# EAGLE design Theremin (EAGLE 6.5.0)
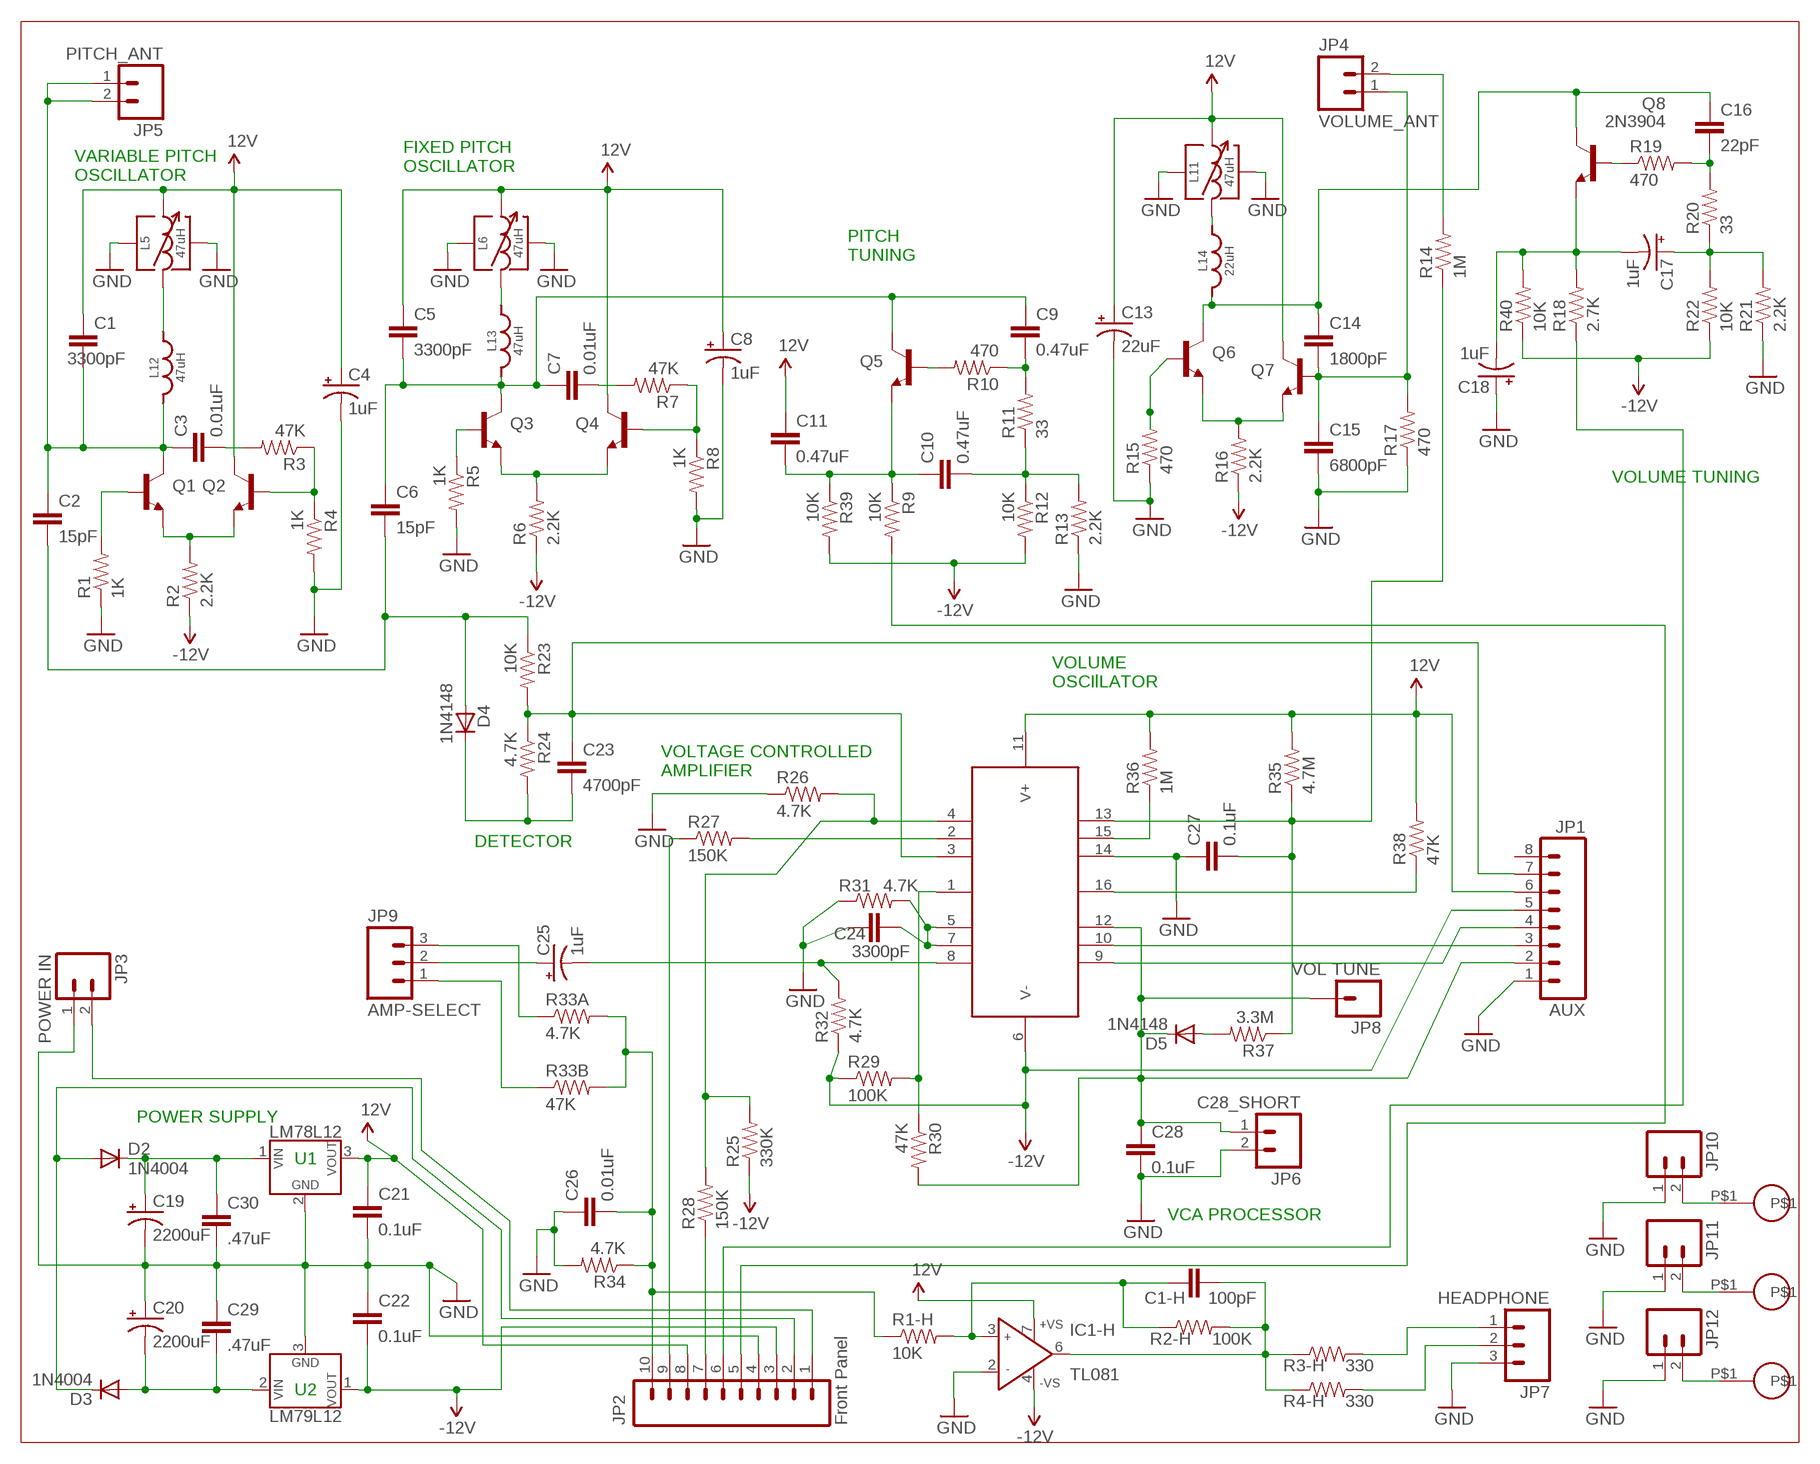
[diagram p0: schematic, sheet 1]

## Parts
C1  3300pF  CAP-9M-RADIAL  [9M-CAP-RADIAL]
C1-H  100pF  CAPPTH  [CAP-PTH-SMALL]
C2  15pF  CAPPTH  [CAP-PTH-SMALL]
C3  0.01uF  CAP-5M-RADIAL  [5M-CAP-RADIAL]
C4  1uF  CAP_POLPTH2  [CPOL-RADIAL-10UF-25V]
C5  3300pF  CAP-9M-RADIAL  [9M-CAP-RADIAL]
C6  15pF  CAPPTH  [CAP-PTH-SMALL]
C7  0.01uF  CAP-5M-RADIAL  [5M-CAP-RADIAL]
C8  1uF  CAP_POLPTH2  [CPOL-RADIAL-10UF-25V]
C9  0.47uF  CAPPTH1  [CAP-PTH-5MM]
C10  0.47uF  CAPPTH1  [CAP-PTH-5MM]
C11  0.47uF  CAPPTH1  [CAP-PTH-5MM]
C13  22uF  CAP_POLPTH4  [CPOL-RADIAL-1000UF-25V]
C14  1800pF  CAPPTH3  [CAP-PTH-LARGE]
C15  6800pF  C5/3  [C5B3]
C16  22pF  CAPEZ  [CAP-PTH-SMALLEZ]
C17  1uF  CAP_POLPTH2  [CPOL-RADIAL-10UF-25V]
C18  1uF  CAP_POLPTH2  [CPOL-RADIAL-10UF-25V]
C19  2200uF  1CM-RADIAL-CAP-POL  [10MM-RADIAL-CPOL]
C20  2200uF  1CM-RADIAL-CAP-POL  [10MM-RADIAL-CPOL]
C21  0.1uF  CAPPTH  [CAP-PTH-SMALL]
C22  0.1uF  CAPPTH  [CAP-PTH-SMALL]
C23  4700pF  CAPPTH  [CAP-PTH-SMALL]
C24  3300pF  CAPPTH  [CAP-PTH-SMALL]
C25  1uF  CAP_POLPTH2  [CPOL-RADIAL-10UF-25V]
C26  0.01uF  CAP-5M-RADIAL  [5M-CAP-RADIAL]
C27  0.1uF  CAPPTH  [CAP-PTH-SMALL]
C28  0.1uF  CAPPTH  [CAP-PTH-SMALL]
C29  .47uF  CAP_  [AXIAL-5MM]
C30  .47uF  CAP_  [AXIAL-5MM]
D2  1N4004  [DO41-10]
D3  1N4004  [DO41-10]
D4  1N4148  DIODE1N4148  [DIODE-1N4148]
D5  1N4148  DIODE1N4148  [DIODE-1N4148]
IC1-H  TL081  AD811N  [DIL08]
JP1  AUX  M081X08  [1X08]
JP2  Front Panel  M10"  [1X10]
JP3  POWER IN  M021X02_NO_SILK  [1X02_NO_SILK]
JP4  VOLUME_ANT  M021X02_NO_SILK  [1X02_NO_SILK]
JP5  PITCH_ANT  M021X02_NO_SILK  [1X02_NO_SILK]
JP6  C28_SHORT  M02LOCK  [1X02_LOCK]
JP7  HEADPHONE  M031X03_NO_SILK  [1X03_NO_SILK]
JP8  VOL TUNE  M01PTH_LONGPAD  [1X01_LONGPAD]
JP9  AMP-SELECT  M03LOCK  [1X03_LOCK]
JP10  M02LOCK  [1X02_LOCK]
JP11  M02LOCK  [1X02_LOCK]
JP12  M02LOCK  [1X02_LOCK]
L5  47uH  SLOT-TEN-SIMPLE  [SLOT-TEN]
L6  47uH  SLOT-TEN-SIMPLE  [SLOT-TEN]
L11  47uH  SLOT-TEN-SIMPLE  [SLOT-TEN]
L12  47uH  DELEVAN-FIXED-INDUCTOR  [FIXED-INDUCTOR-API-DELEVAN]
L13  47uH  DELEVAN-FIXED-INDUCTOR  [FIXED-INDUCTOR-API-DELEVAN]
L14  22uH  DELEVAN-FIXED-INDUCTOR  [FIXED-INDUCTOR-API-DELEVAN]
Q1  2N3904  [TO92]
Q2  2N3904  [TO92]
Q3  2N3904  [TO92]
Q4  2N3904  [TO92]
Q5  2N3904  [TO92]
Q6  2N3904  [TO92]
Q7  2N3904  [TO92]
Q8  2N3904  [TO92]
R1  1K  RESISTORPTH-1/4W  [AXIAL-0.4]
R1-H  10K  RESISTORPTH-1/4W  [AXIAL-0.4]
R2  2.2K  RESISTORPTH-1/4W  [AXIAL-0.4]
R2-H  100K  RESISTORPTH-1/4W  [AXIAL-0.4]
R3  47K  RESISTORPTH-1/4W  [AXIAL-0.4]
R3-H  330  RESISTORPTH-1/4W  [AXIAL-0.4]
R4  1K  RESISTORPTH-1/4W  [AXIAL-0.4]
R4-H  330  RESISTORPTH-1/4W  [AXIAL-0.4]
R5  1K  RESISTORPTH-1/4W  [AXIAL-0.4]
R6  2.2K  RESISTORPTH-1/4W  [AXIAL-0.4]
R7  47K  RESISTORPTH-1/4W  [AXIAL-0.4]
R8  1K  RESISTORPTH-1/4W  [AXIAL-0.4]
R9  10K  RESISTORPTH-1/4W  [AXIAL-0.4]
R10  470  RESISTORPTH-1/4W  [AXIAL-0.4]
R11  33  RESISTORPTH-1/4W  [AXIAL-0.4]
R12  10K  RESISTORPTH-1/4W  [AXIAL-0.4]
R13  2.2K  RESISTORPTH-1/4W  [AXIAL-0.4]
R14  1M  RESISTORPTH-1/4W  [AXIAL-0.4]
R15  470  RESISTORPTH-1/4W  [AXIAL-0.4]
R16  2.2K  RESISTORPTH-1/4W  [AXIAL-0.4]
R17  470  RESISTORPTH-1/4W  [AXIAL-0.4]
R18  2.7K  RESISTORPTH-1/4W  [AXIAL-0.4]
R19  470  RESISTORPTH-1/4W  [AXIAL-0.4]
R20  33  RESISTORPTH-1/4W  [AXIAL-0.4]
R21  2.2K  RESISTORPTH-1/4W  [AXIAL-0.4]
R22  10K  RESISTORPTH-1/4W  [AXIAL-0.4]
R23  10K  RESISTORPTH-1/4W  [AXIAL-0.4]
R24  4.7K  RESISTORPTH-1/4W  [AXIAL-0.4]
R25  330K  RESISTORPTH-1/4W  [AXIAL-0.4]
R26  4.7K  RESISTORPTH-1/4W  [AXIAL-0.4]
R27  150K  RESISTORPTH-1/4W  [AXIAL-0.4]
R28  150K  RESISTORPTH-1/4W  [AXIAL-0.4]
R29  100K  RESISTORPTH-1/4W  [AXIAL-0.4]
R30  47K  RESISTORPTH-1/4W  [AXIAL-0.4]
R31  4.7K  RESISTORPTH-1/4W  [AXIAL-0.4]
R32  4.7K  RESISTORPTH-1/4W  [AXIAL-0.4]
R33A  4.7K  RESISTORPTH-1/4W  [AXIAL-0.4]
R33B  47K  RESISTORPTH-1/4W  [AXIAL-0.4]
R34  4.7K  RESISTORPTH-1/4W  [AXIAL-0.4]
R35  4.7M  RESISTORPTH-1/4W  [AXIAL-0.4]
R36  1M  RESISTORPTH-1/4W  [AXIAL-0.4]
R37  3.3M  RESISTORPTH-1/4W  [AXIAL-0.4]
R38  47K  RESISTORPTH-1/4W  [AXIAL-0.4]
R39  10K  RESISTORPTH-1/4W  [AXIAL-0.4]
R40  10K  RESISTORPTH-1/4W  [AXIAL-0.4]
U1  LM78L12  [TO-92]
U2  LM79L12  [TO-92]
U3  LM13700N  LM13600  [DIL16]
U$1  GROUND-SCREW  [GROUND-SCREW]
U$2  GROUND-SCREW  [GROUND-SCREW]
U$3  GROUND-SCREW  [GROUND-SCREW]

## Nets
5V: C1.P$1 C4.1(+) C5.P$1 C8.1(+) C11.1 C13.1(+) C21.1 IC1-H.7(+VS) JP1.6 JP2.8 L5.IN$1 L6.IN$1 L11.IN$1 Q2.1(C) Q4.1(C) Q7.1(C) R35.P$2 R36.P$2 R38.P$2 U1.3(VOUT) U3.11(V+) ; supply symbol labelled 12V
-12V: JP1.5 R2.P$1 R16.P$1 R22.P$1 R29.P$1 R32.P$1 R40.P$1 U3.6(V-)
GND: C4.2(-) C8.2(-) C13.2(-) C15.2 C18.1(+) C19.P$2(-) C20.P$1(+) C21.2 C22.1 C24.1 C26.P$1 C27.1 C28.2 C29.P$1 C30.P$2 IC1-H.2(IN-) JP1.1 JP2.4 JP3.1 JP6.2 JP7.3 JP10.1 JP11.1 JP12.1 L5.TAB@7 L5.TAB@8 L6.TAB@7 L6.TAB@8 L11.TAB@7 L11.TAB@8 R1.P$1 R4.P$2 R5.P$2 R8.P$2 R13.P$1 R15.P$1 R17.P$1 R21.P$1 R26.P$1 R31.P$1 R34.P$2 U1.2(GND) U2.3(GND) U3.14(IN-PLUS-B)
N$1: Q8.2(B) R19.P$1
N$2: C16.2 R19.P$2 R20.P$2
N$3: C17.1(+) R20.P$1 R21.P$2 R22.P$2
N$4: C14.1 C16.1 L14.P$2 Q6.1(C) Q8.1(C)
N$5: C17.2(-) C18.2(-) Q8.3(E) R18.P$2 R40.P$2
N$6: Q6.3(E) Q7.3(E) R16.P$2
N$7: JP2.6 R18.P$1
N$8: Q6.2(B) R15.P$2
N$9: C14.2 C15.1 JP4.1 Q7.2(B) R17.P$2
N$10: L5.OUT$3(OUT$2) L12.P$1
N$11: L11.OUT$3(OUT$2) L14.P$1
N$12: C20.P$2(-) C29.P$2 D3.A U2.2(VIN)
N$13: C19.P$1(+) C30.P$1 D2.C U1.1(VIN)
N$14: D2.A D3.C JP2.2
N$15: JP4.2 R14.P$2
N$16: Q1.2(B) R1.P$2
N$17: C1.P$2 C2.1 C3.P$1 JP5.1 JP5.2 L12.P$2 Q1.1(C)
N$18: Q1.3(E) Q2.3(E) R2.P$2
N$19: Q2.2(B) R3.P$1 R4.P$1
N$20: C2.2 C6.2 D4.A R23.P$1
N$21: R38.P$1 U3.16(BIAS-IN-B)
N$22: JP1.3 U3.10(B-IN-B)
N$23: JP1.4 U3.9(B-OUT-B)
N$24: C28.1 D5.C JP1.2 JP6.1 JP8.1 R30.P$2 U3.12(OUT-B)
N$25: D5.A R37.P$2
N$26: C27.2 R14.P$1 R35.P$1 R37.P$1 U3.13(IN-MINUS-B)
N$27: R29.P$2 R30.P$1 U3.1(BIAS-IN-A)
N$28: R36.P$1 U3.15(DIODE-BIAS-B)
N$29: C25.2(-) R32.P$2 U3.8(B-OUT-A)
N$30: C25.1(+) JP9.2
N$31: C1-H.1 IC1-H.3(IN+) R1-H.P$2 R2-H.P$1
N$32: C24.2 R31.P$2 U3.5(OUT-A) U3.7(B-IN-A)
N$33: R27.P$2 U3.2(DIODE-BIAS-A)
N$34: JP2.9 R27.P$1
N$35: JP2.7 R28.P$1
N$36: R25.P$2 R26.P$2 R28.P$2 U3.4(IN-MINUS-A)
N$37: C23.1 JP1.7 R23.P$2 R24.P$1 U3.3(IN-PLUS-A)
N$38: C23.2 D4.C R24.P$2
N$39: JP2.1 JP3.2
N$40: C3.P$2 R3.P$2
N$41: C5.P$2 C6.1 C7.P$1 C9.1 L13.P$2 Q3.1(C) Q5.1(C)
N$42: Q3.2(B) R5.P$1
N$43: Q3.3(E) Q4.3(E) R6.P$2
N$44: L6.OUT$3(OUT$2) L13.P$1
N$45: C10.1 C11.2 Q5.3(E) R9.P$1 R39.P$1
N$46: C7.P$2 R7.P$2
N$47: JP2.5 R9.P$2
N$48: Q4.2(B) R7.P$1 R8.P$1
N$49: Q5.2(B) R10.P$2
N$50: C9.2 R10.P$1 R11.P$2
N$51: C10.2 R11.P$1 R12.P$1 R13.P$2
N$52: JP9.3 R33A.P$1
N$53: JP9.1 R33B.P$1
N$54: C26.P$2 JP2.10 R1-H.P$1 R33A.P$2 R33B.P$2 R34.P$1
N$55: C1-H.2 IC1-H.6(OUT) R2-H.P$2 R3-H.P$1 R4-H.P$1
N$56: JP7.1 R3-H.P$2
N$57: JP7.2 R4-H.P$2
N$58: JP10.2 U$2.P$1
N$59: JP11.2 U$1.P$1
N$60: JP12.2 U$3.P$1
VNEG: C22.2 IC1-H.4(-VS) JP2.3 R6.P$1 R12.P$2 R25.P$1 R39.P$2 U2.1(VOUT) ; supply symbol labelled -12V
Unconnected: JP1.8

## Notes on the sheet
- FIXED PITCH
  OSCILLATOR
- VARIABLE PITCH
  OSCILLATOR
- PITCH
  TUNING
- VOLUME TUNING
- VOLUME 
  OSCIlLATOR
- VOLTAGE CONTROLLED
  AMPLIFIER
- DETECTOR
- POWER SUPPLY
- LM78L12
- U1
- VCA PROCESSOR
- U2
- LM79L12

## Library data of the parts
C1 C5 = marky-parts:CAP-9M-RADIAL
C1-H C2 C6 C9-C11 C14 C21-C24 C27-C30 = SparkFun-Capacitors:CAP: Capacitor Standard 0603 ceramic capacitor, and 0.1" leaded capacitor.
C3 C7 C26 = marky-parts:CAP-5M-RADIAL
C4 C8 C17 C18 C25 = SparkFun-Passives:CAP_POL: Capacitor Polarized These are standard SMD and PTH capacitors. Normally 10uF, 47uF, and 100uF in electrolytic and tantalum varieties. Always verify the external diameter of the through hole cap, it varies with capacity, voltage, and manufacturer. The EIA devices should be standard.
C13 = SparkFun-Capacitors:CAP_POL: Capacitor Polarized These are standard SMD and PTH capacitors. Normally 10uF, 47uF, and 100uF in electrolytic and tantalum varieties. Always verify the external diameter of the through hole cap, it varies with capacity, voltage, and manufacturer. The EIA devices should be standard.
C15 = capacitor-wima:C: CAPACITOR naming: grid - package width
C16 = SparkFun-Passives:CAP: Capacitor Standard 0603 ceramic capacitor, and 0.1" leaded capacitor.
C19 C20 = marky-parts:1CM-RADIAL-CAP-POL: 1cm Radial Polarized Capacitor
D2 D3 = diode:1N4004: DIODE general purpose rectifier, 1 A
D4 D5 = SparkFun-DiscreteSemi:DIODE: Diode These are standard reverse protection diodes and small signal diodes. SMA package can handle up to about 1A. SOD-323 can handle about 200mA. What the SOD-323 package when ordering, there are some mfgs out there that are 5-pin packages.
IC1-H = analog-devices:AD811: High Performance Video Op Amp Source: http://www.analog.com/static/imported-files/data_sheets/AD811.pdf; MF: ALTERA CORPORATION; MPN: AD811AN; OC_FARNELL: 1464857; OC_NEWARK: 05F7667
JP1 = SparkFun-Connectors:M08: Header 8 Standard 8-pin 0.1" header. Use with straight break away headers (SKU : PRT-00116), right angle break away headers (PRT-00553), swiss pins (PRT-00743), machine pins (PRT-00117), and female headers (PRT-00115).
JP2 = SparkFun-Connectors:M10: Header 10 Standard 10-pin 0.1" header. Use with straight break away headers (SKU : PRT-00116), right angle break away headers (PRT-00553), swiss pins (PRT-00743), machine pins (PRT-00117), and female headers (PRT-00115).
JP3-JP6 JP10-JP12 = SparkFun-Connectors:M02: Standard 2-pin 0.1" header. Use with - straight break away headers ( PRT-00116) - right angle break away headers (PRT-00553) - swiss pins (PRT-00743) - machine pins (PRT-00117) - female headers (PRT-00115) Molex polarized connector foot print use with: PRT-08233 with associated crimp pins and housings. 2.54_SCREWTERM for use with PRT-10571. 3.5mm Screw Terminal footprints for PRT-08084 5mm Screw Terminal footprints for use with PRT-08433
JP7 JP9 = SparkFun-Connectors:M03: Header 3 Standard 3-pin 0.1" header. Use with straight break away headers (SKU : PRT-00116), right angle break away headers (PRT-00553), swiss pins (PRT-00743), machine pins (PRT-00117), and female headers (PRT-00115). Molex polarized connector foot print use with SKU : PRT-08232 with associated crimp pins and housings.
JP8 = SparkFun-Connectors:M01: Header 1 Standard 1-pin 0.1" header. Use with straight break away headers (SKU : PRT-00116), right angle break away headers (PRT-00553), swiss pins (PRT-00743), machine pins (PRT-00117), and female headers (PRT-00115).
L5 L6 L11 = marky-parts:SLOT-TEN-SIMPLE
L12-L14 = marky-parts:DELEVAN-FIXED-INDUCTOR
Q1-Q8 = transistor:2N3904: NPN TRANSISTOR
R1 R1-H R2 R2-H R3 R3-H R4 R4-H R5-R32 R33A R33B R34-R40 = SparkFun-Resistors:RESISTOR: Resistor Basic schematic elements and footprints for 0603, 1206, and PTH resistors.
U1 = marky-parts:LM78L12: LM78LXX Series 3-Terminal Positive Regulators
U2 = marky-parts:LM79L12: -12V regulator
U3 = marky-parts:LM13600: LM13600 Operational Transconductance Amplifiers with Linearizing Diodes and Buffers
U$1-U$3 = marky-parts:GROUND-SCREW: Screw hole with a pad that can be grounded

## Board
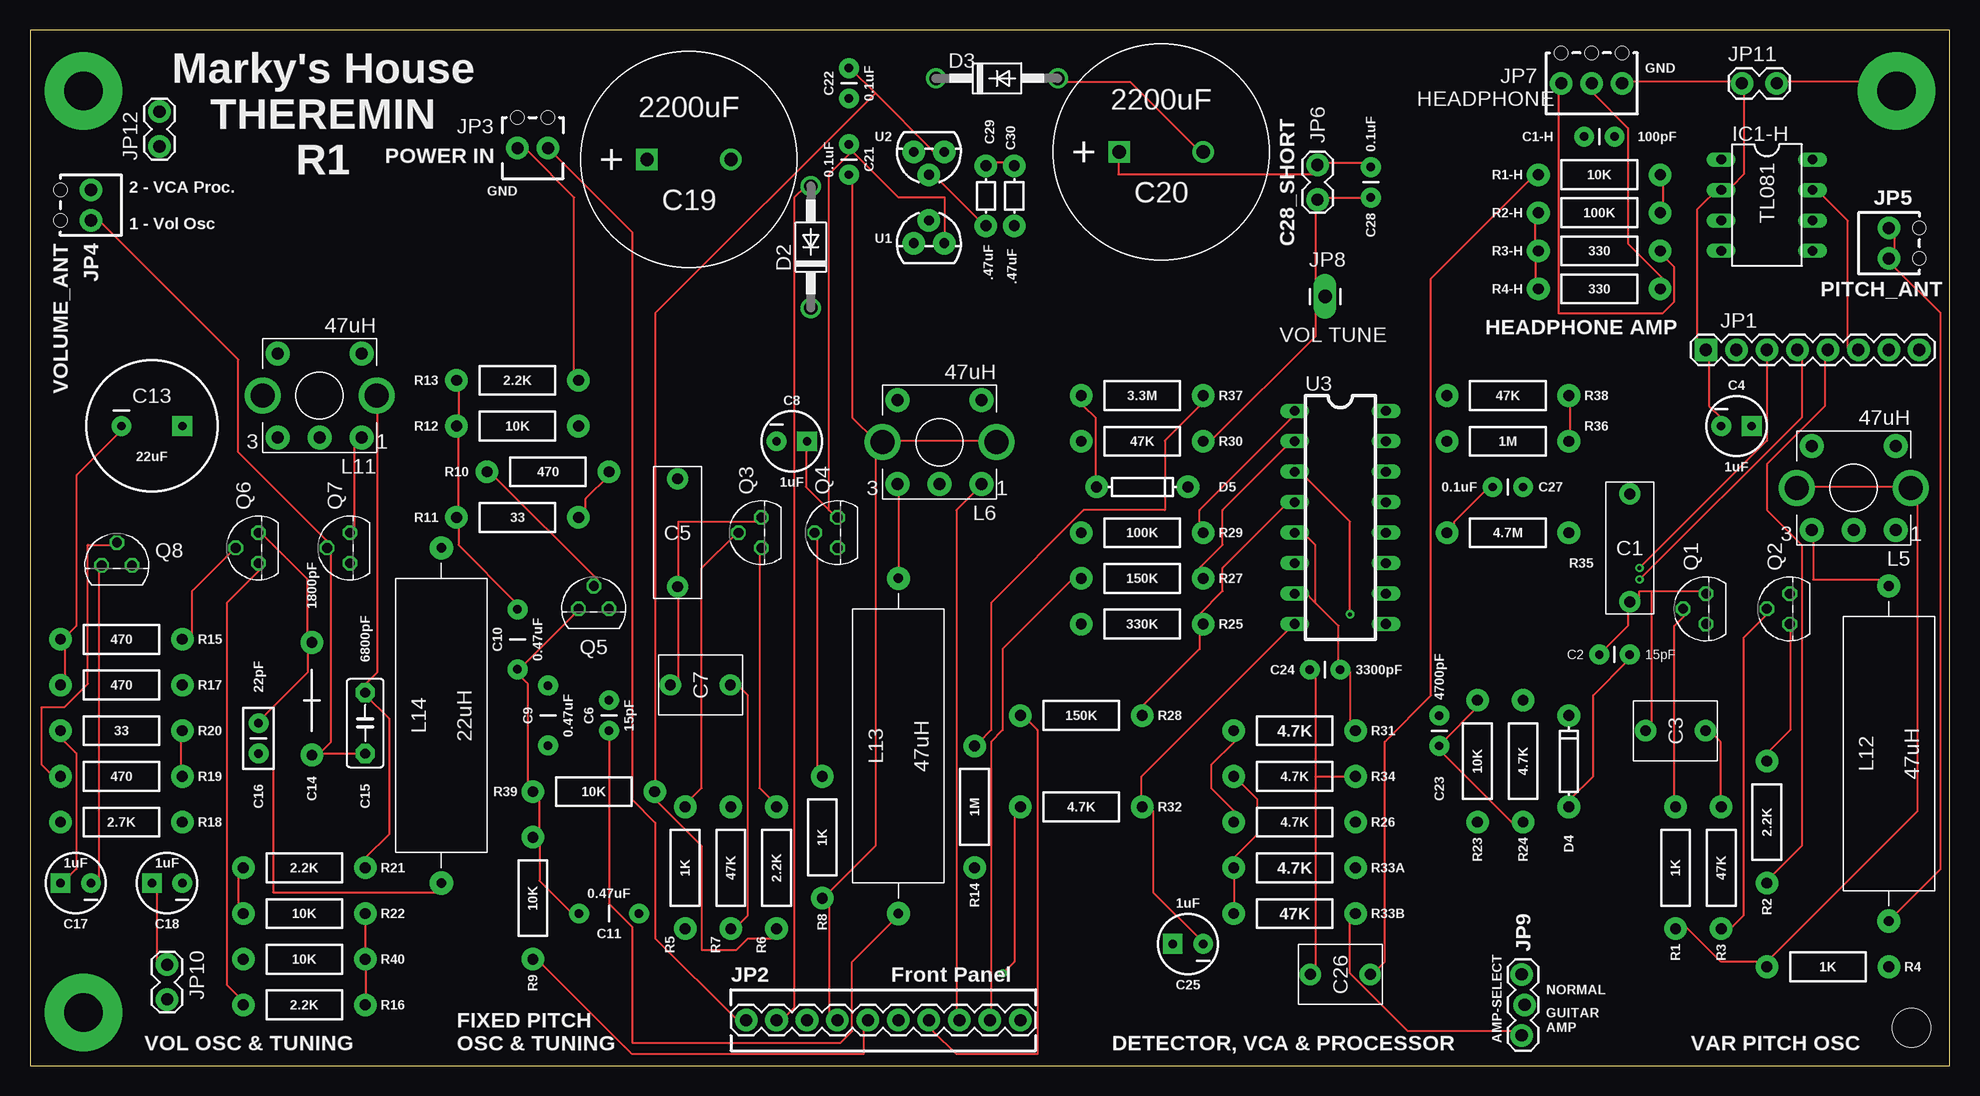
[diagram p1: board, top side]
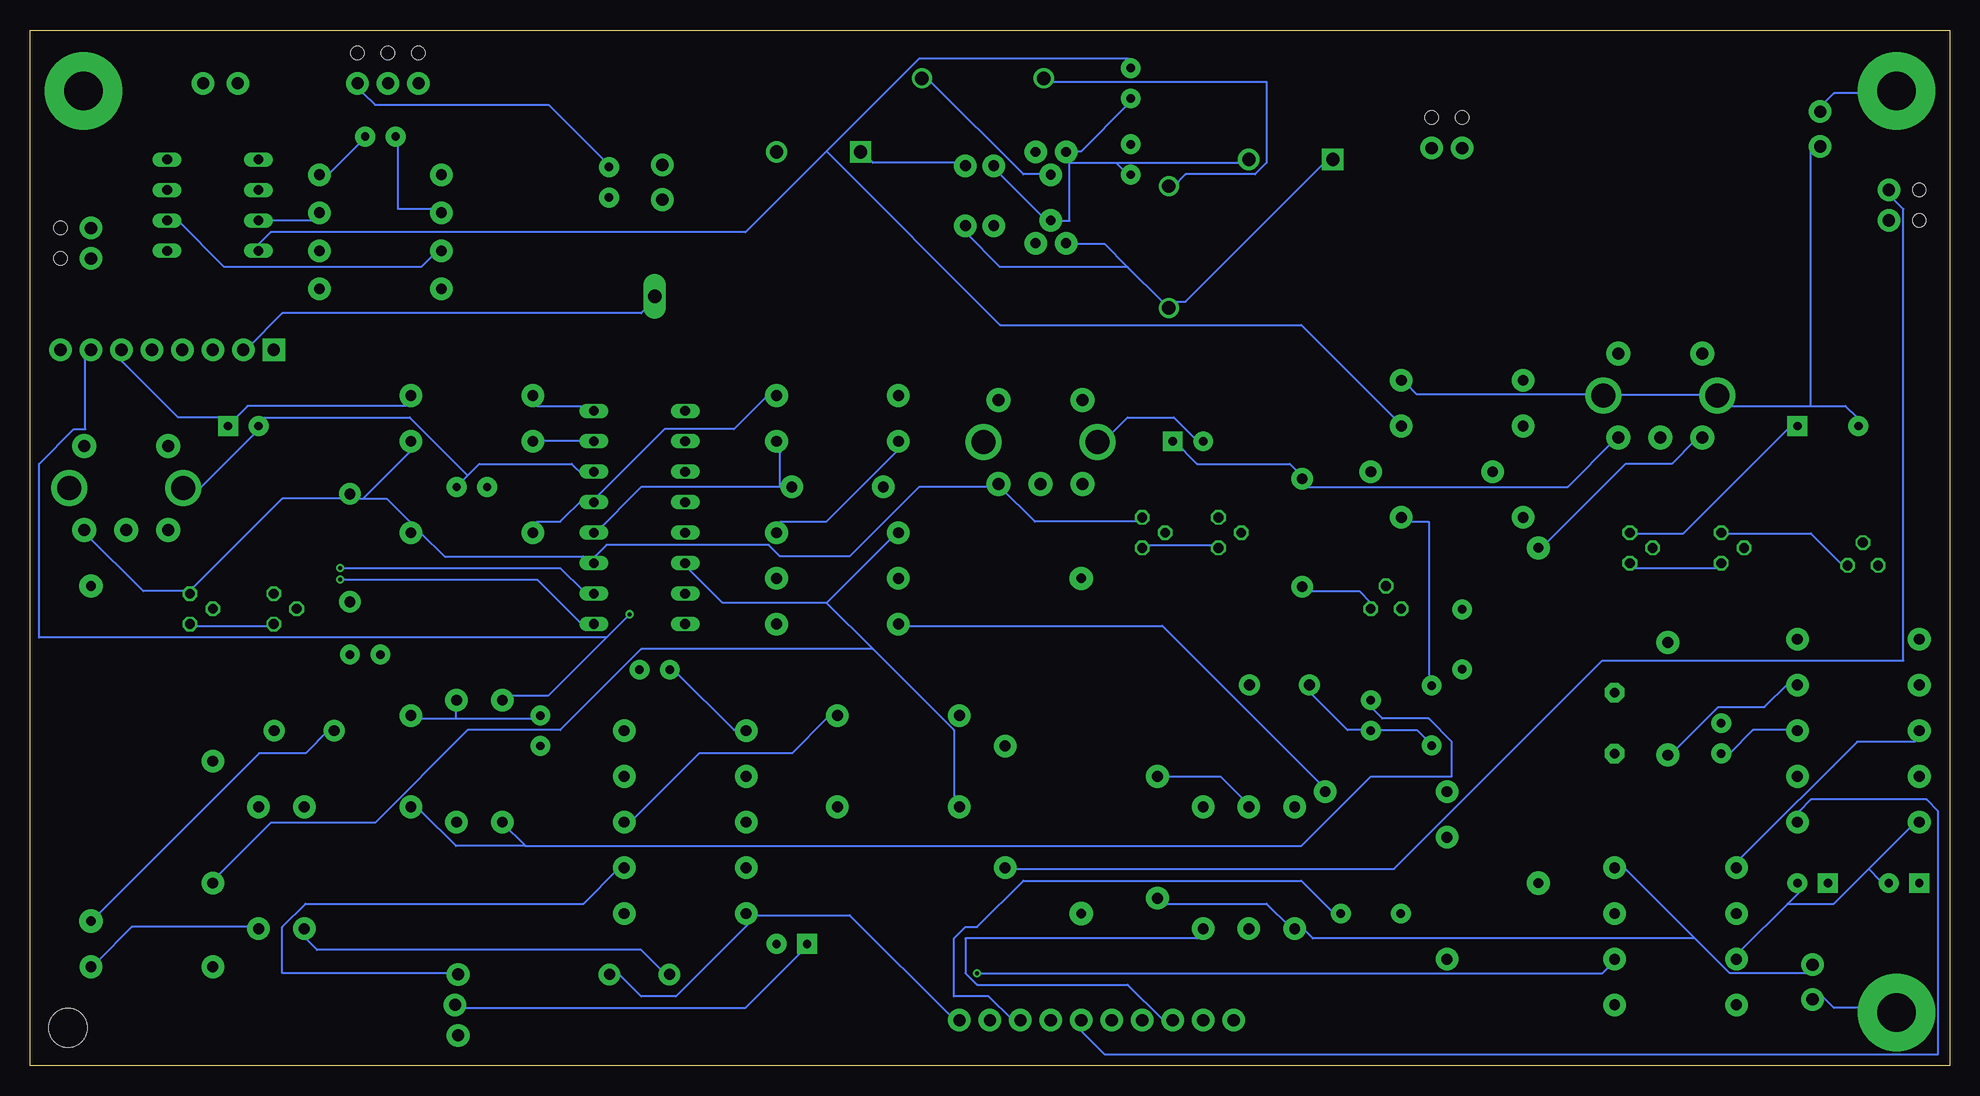
[diagram p2: board, bottom side, seen from below]

Size 160.02 x 86.36 mm. Coordinates in mm from the lower left corner, seen from the top.
Outline: 0,0 160,0 160.02,86.36 0,86.36 0,0
Copper layers (1*16): Top 0.0356mm / dielectric 1.5011mm / Bottom 0.0356mm
Design rules "LaenPCBOrder": minimum track width 6mil, minimum drill 13mil, track to track 6mil, track to pad 6mil, pad to pad 6mil, via to via 6mil, smd to smd 6mil, copper to edge 15mil, drill to drill 6mil, minimum pad ring 7mil, minimum via ring 7mil, stop-mask expansion 3mil, vias tented up to drill 0mil, thermal gap 10mil
Holes 3.2 mm at 156.84,3.17
Holes 1.1 mm at 2.54,70.48 2.54,73.03 157.48,69.85 157.48,67.31 127.64,84.45 130.18,84.45 132.72,84.45 40.64,79.06 43.18,79.06

### Footprints (pad centres in the part's own frame; a part is rotated, then mirrored left to right if it is on the bottom)
9M-CAP-RADIAL = drill 0.9 pad 1.778: P$1 0,4.5; P$2 0,-4.5
CAP-PTH-SMALL = drill 0.7 pad 1.651: 1 0,0; 2 2.54,0
5M-CAP-RADIAL = drill 0.9 pad 1.778: P$1 0,2.5; P$2 0,-2.5
CPOL-RADIAL-10UF-25V = drill 0.7 pad 1.651 square: 1 1.27,0 | drill 0.7 pad 1.651: 2 -1.27,0
CAP-PTH-5MM = drill 0.7 pad 1.651: 1 -2.5,0; 2 2.5,0
CPOL-RADIAL-1000UF-25V = drill 0.7 pad 1.651 square: 1 2.54,0 | drill 0.7 pad 1.651: 2 -2.54,0
CAP-PTH-LARGE = drill 0.9 pad 1.905: 1 -4.826,0; 2 4.572,0
C5B3 = drill 0.813 pad 1.6 octagon: 1 -2.54,0; 2 2.54,0
CAP-PTH-SMALLEZ = drill 0.7 pad 1.651: 1 0,0; 2 2.54,0
10MM-RADIAL-CPOL = drill 1.1 pad 1.778 square: P$1 -3.5,0 | drill 1.1 pad 1.778: P$2 3.5,0
AXIAL-5MM = drill 0.9 pad 1.88: P$1 -2.5,0; P$2 2.5,0
DO41-10 = drill 1.118: A 5.08,0; C -5.08,0
DIODE-1N4148 = drill 0.9 pad 1.88: A -3.81,0; C 3.81,0
DIL08 = drill 0.813 long: 1 -3.81,-3.81; 2 -1.27,-3.81; 3 1.27,-3.81; 4 3.81,-3.81; 5 3.81,3.81; 6 1.27,3.81; 7 -1.27,3.81; 8 -3.81,3.81
1X08 = drill 1.016 pad 1.88 square: 1 0,0 | drill 1.016 pad 1.88: 2 2.54,0; 3 5.08,0; 4 7.62,0; 5 10.16,0; 6 12.7,0; 7 15.24,0; 8 17.78,0
1X10 = drill 1.016 pad 1.88: 1 0,0; 2 2.54,0; 3 5.08,0; 4 7.62,0; 5 10.16,0; 6 12.7,0; 7 15.24,0; 8 17.78,0; 9 20.32,0; 10 22.86,0
1X02_NO_SILK = drill 1.016 pad 1.88: 1 0,0; 2 2.54,0
1X02_LOCK = drill 1.016 pad 1.88: 1 -0.178,0; 2 2.718,0
1X03_NO_SILK = drill 1.016 pad 1.88: 1 0,0; 2 2.54,0; 3 5.08,0
1X01_LONGPAD = drill 1.118 pad 1.88 long: 1 0,0
1X03_LOCK = drill 1.016 pad 1.88: 1 0,0.127; 2 2.54,-0.127; 3 5.08,0.127
SLOT-TEN = drill 1 pad 2: IN$1 -3.5,3.5; OUT$3 3.5,3.5; P$2 0,3.5; P$4 3.5,-3.5; P$6 -3.5,-3.5 | drill 2 pad 3: TAB@7 -4.75,0; TAB@8 4.75,0
FIXED-INDUCTOR-API-DELEVAN = drill 0.8 pad 1.93: P$1 0,13.97; P$2 0,-13.97
TO92 = drill 0.813 octagon: 1 1.27,0; 2 0,1.905; 3 -1.27,0
AXIAL-0.4 = drill 0.9 pad 1.88: P$1 -5.08,0; P$2 5.08,0
TO-92 = drill 0.813 pad 1.88: 1 -1.27,0; 2 0,1.905; 3 1.27,0
DIL16 = drill 0.813 long: 1 -8.89,-3.81; 2 -6.35,-3.81; 3 -3.81,-3.81; 4 -1.27,-3.81; 5 1.27,-3.81; 6 3.81,-3.81; 7 6.35,-3.81; 8 8.89,-3.81; 9 8.89,3.81; 10 6.35,3.81; 11 3.81,3.81; 12 1.27,3.81; 13 -1.27,3.81; 14 -3.81,3.81; 15 -6.35,3.81; 16 -8.89,3.81
GROUND-SCREW = drill 3.2 pad 6.452: P$1 0,0

### Placement (x,y rotation side)
C1  133.35,43.18 0 top
C1-H  132.08,77.47 180 top
C2  130.81,34.29 0 top
C3  137.16,27.94 90 top
C4  142.24,53.34 0 top
C5  53.98,44.45 0 top
C6  48.26,27.94 90 top
C7  55.88,31.75 90 top
C8  63.5,52.07 0 top
C9  43.18,29.21 90 top
C10  40.64,35.56 90 top
C11  48.26,12.7 180 top
C13  10.16,53.34 0 top
C14  23.5,30.48 270 top
C15  27.94,28.57 90 top
C16  19.05,28.57 270 top
C17  3.81,15.24 180 top
C18  11.43,15.24 180 top
C19  54.93,75.56 0 top
C20  94.3,76.2 0 top
C21  68.26,76.83 270 top
C22  68.26,80.64 90 top
C23  117.47,26.67 90 top
C24  106.68,33.02 0 top
C25  96.52,10.16 180 top
C26  109.22,7.62 90 top
C27  124.46,48.26 180 top
C28  111.76,72.39 90 top
C29  79.68,72.54 270 top
C30  82.05,72.54 90 top
D2  65.09,68.26 90 top
D3  80.6,82.33 0 top
D4  128.27,25.4 90 top
D5  92.71,48.26 0 top
IC1-H  144.78,71.75 270 top
JP1  139.7,59.69 0 top
JP2  59.69,3.81 0 top
JP3  40.64,76.52 0 top
JP4  5.08,70.48 90 top
JP5  154.94,67.31 90 top
JP6  107.31,72.39 90 top
JP7  127.64,81.92 0 top
JP8  107.95,64.14 0 top
JP9  124.46,2.54 90 top
JP10  11.43,8.26 270 top
JP11  142.88,81.92 0 top
JP12  10.79,76.83 90 top
L5  152,48.19 180 top
L6  75.81,52 180 top
L11  24.13,55.88 180 top
L12  154.94,26.04 0 top
L13  72.39,26.67 0 top
L14  34.29,29.21 0 top
Q1  139.7,38.1 90 top
Q2  146.69,38.1 90 top
Q3  60.96,44.45 90 top
Q4  67.31,44.45 90 top
Q5  46.99,38.1 0 top
Q6  19.05,43.18 90 top
Q7  26.67,43.18 90 top
Q8  7.24,41.72 0 top
R1  137.16,16.51 90 top
R1-H  130.81,74.3 0 top
R2  144.78,20.32 90 top
R2-H  130.81,71.12 180 top
R3  140.97,16.51 90 top
R3-H  130.81,67.94 0 top
R4  149.86,8.26 180 top
R4-H  130.81,64.77 0 top
R5  54.61,16.51 270 top
R6  62.23,16.51 90 top
R7  58.42,16.51 270 top
R8  66.04,19.05 270 top
R9  41.91,13.97 270 top
R10  43.18,49.53 180 top
R11  40.64,45.72 0 top
R12  40.64,53.34 0 top
R13  40.64,57.15 180 top
R14  78.74,21.59 270 top
R15  7.62,35.56 0 top
R16  22.86,5.08 180 top
R17  7.62,31.75 0 top
R18  7.62,20.32 180 top
R19  7.62,24.13 0 top
R20  7.62,27.94 0 top
R21  22.86,16.51 180 top
R22  22.86,12.7 180 top
R23  120.65,25.4 90 top
R24  124.46,25.4 90 top
R25  92.71,36.83 0 top
R26  105.41,20.32 0 top
R27  92.71,40.64 0 top
R28  87.63,29.21 0 top
R29  92.71,44.45 0 top
R30  92.71,52.07 0 top
R31  105.41,27.94 0 top
R32  87.63,21.59 0 top
R33A  105.41,16.51 180 top
R33B  105.41,12.7 180 top
R34  105.41,24.13 0 top
R35  123.19,44.45 0 top
R36  123.19,52.07 0 top
R37  92.71,55.88 180 top
R38  123.19,55.88 0 top
R39  46.99,22.86 0 top
R40  22.86,8.89 180 top
U1  74.93,68.58 0 top
U2  74.93,76.2 180 top
U3  109.22,45.72 270 top
U$1  155.57,81.28 0 top
U$2  4.45,4.45 0 top
U$3  4.45,81.28 0 top

### Tracks (layer width: path | path; a pad name or v marks a point on that pad's centre or on a via)
5V
  Top 0.152: IC1-H.7 148.64,73.36 151.54,70.46 151.54,59.84 JP1.6 | R36.P$2 128.37,52.12 128.37,55.02 R38.P$2 | Q7.1 27.03,44.4 27.03,52.12 L11.IN$1 | 68.53,76.25 72.39,72.39 76.25,72.39 76.25,69.49 U1.3 | 66.6,46.33 64.67,48.26 64.67,52.12 C8.1 | 66.6,46.33 67.56,45.36 Q4.1 | 68.53,76.25 66.6,74.32 66.6,46.33 | 68.53,76.25 C21.1 | JP2.8 77.22,3.86 77.22,46.33 79.15,48.26 L6.IN$1
  Bottom 0.152: R38.P$2 128.37,55.02 141.88,55.02 142.85,54.05 C4.1 143.81,54.05 147.68,54.05 152.5,58.88 JP1.6 | 146.71,39.57 138.99,47.3 134.16,47.3 C1.P$1 133.2,47.3 132.23,47.3 | 146.71,39.57 150.57,39.57 155.4,44.4 L5.IN$1 | 146.71,39.57 Q2.1 | 132.23,47.3 130.3,47.3 128.37,45.36 R35.P$2 127.41,44.4 125.48,42.47 113.89,42.47 U3.11 112.93,42.47 111.96,43.43 98.45,43.43 97.48,42.47 91.69,42.47 85.9,48.26 80.11,48.26 L6.IN$1 79.15,48.26 76.25,45.36 67.56,45.36 Q4.1 | 132.23,47.3 128.37,51.16 R36.P$2 | C11.1 51.16,12.55 54.05,15.44 77.22,15.44 81.08,11.58 82.04,11.58 83.01,10.62 83.01,5.79 80.11,5.79 78.18,3.86 JP2.8 | C13.1 13.51,53.09 22.2,44.4 27.03,44.4 Q7.1 | C8.1 64.67,52.12 62.74,50.19 55.02,50.19 54.05,49.23 C5.P$1 54.05,48.26 31.85,48.26 27.99,52.12 L11.IN$1
-12V  (via drill 0.33)
  Top 0.152: R2.P$1 144.78,15.44 147.68,18.34 147.68,43.43 144.78,46.33 144.78,50.19 149.61,55.02 149.61,58.88 JP1.5 | R16.P$1 27.99,5.79 27.99,8.69 R40.P$1 27.99,9.65 27.99,12.55 R22.P$1 | v81.08,7.72 82.04,8.69 82.04,21.23 R32.P$1
  Bottom 0.152: 93.62,38.61 102.31,38.61 105.21,41.5 U3.6 | 93.62,38.61 87.83,44.4 R29.P$1 | 93.62,38.61 89.76,34.75 | 89.76,34.75 83.01,27.99 83.01,22.2 R32.P$1 | v81.08,7.72 28.96,7.72 27.99,8.69 R40.P$1 | 89.76,34.75 109.07,34.75 115.82,27.99 123.55,27.99 131.27,20.27 139.95,20.27 144.78,15.44 R2.P$1
GND
  Top 0.152: JP2.4 66.6,3.86 66.6,13.51 R8.P$2 66.6,14.48 70.46,18.34 70.46,51.16 L6.TAB@8 | C18.1 10.62,14.48 10.62,8.69 JP10.1 | R17.P$1 2.9,31.85 2.9,34.75 R15.P$1 2.9,35.71 3.86,36.68 3.86,49.23 7.72,53.09 C13.2 | L11.TAB@7 28.96,55.02 28.96,32.82 27.99,31.85 C15.2 27.99,30.89 29.92,28.96 29.92,19.3 27.99,17.37 R21.P$1 | JP3.1 41.5,76.25 45.36,72.39 45.36,57.91 R13.P$1 | L6.TAB@7 80.11,52.12 71.42,52.12 L6.TAB@8 | C28.2 111,75.29 108.1,75.29 JP6.2 107.14,74.32 90.73,74.32 90.73,76.25 C20.P$1 | C29.P$1 80.11,75.29 82.04,75.29 C30.P$2 | L6.TAB@8 70.46,52.12 68.53,54.05 68.53,74.32 C21.2 | 144.78,8.69 140.92,8.69 138.02,11.58 R1.P$1 | 107.14,24.13 107.14,32.82 C24.1 | 107.14,24.13 107.14,7.72 C26.P$1 | R26.P$1 100.38,21.23 98.45,23.16 98.45,25.09 100.38,27.03 R31.P$1 | 107.14,24.13 R34.P$2 | JP7.3 133.2,82.04 141.88,82.04 JP11.1 142.85,81.08 142.85,74.32 141.88,73.36 IC1-H.2 140.92,73.36 138.99,71.42 138.99,59.84 JP1.1 139.95,58.88 139.95,55.02 140.92,54.05 C4.2 | L5.TAB@8 147.68,48.26 156.36,48.26 L5.TAB@7 157.33,47.3 157.33,21.23 144.78,8.69 | 144.78,8.69 R4.P$2
  Bottom 0.152: R8.P$2 65.63,13.51 56.95,13.51 55.02,11.58 R5.P$2 54.05,11.58 53.09,10.62 21.23,10.62 | 21.23,10.62 18.34,7.72 11.58,7.72 JP10.1 | 21.23,10.62 27.03,16.41 R21.P$1 | 11.58,55.02 19.3,55.02 L11.TAB@8 20.27,55.98 27.99,55.98 L11.TAB@7 28.96,55.98 44.4,55.98 45.36,56.95 R13.P$1 | 11.58,55.02 8.69,55.02 7.72,54.05 C13.2 | 11.58,55.02 11.58,76.25 JP12.1 | C8.2 62.74,52.12 64.67,54.05 68.53,54.05 70.46,52.12 L6.TAB@8 | 69.49,75.29 68.53,74.32 C21.2 | 73.36,75.29 69.49,75.29 | C22.1 68.53,80.11 72.39,76.25 73.36,76.25 U2.3 73.36,75.29 | 69.49,75.29 58.88,75.29 C19.P$2 | C29.P$1 79.15,74.32 75.29,70.46 U1.2 74.32,70.46 73.36,70.46 73.36,75.29 | C20.P$1 90.73,76.25 89.76,75.29 82.04,75.29 C30.P$2 | C24.1 106.17,32.82 101.35,27.99 100.38,27.99 R31.P$1 | R1.P$1 137.06,10.62 136.09,9.65 109.07,9.65 107.14,7.72 C26.P$1 | 123.55,49.23 124.51,48.26 C27.1 | 123.55,49.23 122.58,50.19 114.86,50.19 113.89,49.23 U3.14 | L5.TAB@8 146.71,48.26 145.75,48.26 140.92,53.09 C4.2 140.92,54.05 128.37,54.05 123.55,49.23 | C28.2 111.96,75.29 116.79,80.11 131.27,80.11 132.23,81.08 JP7.3
N$1
  Top 0.152: Q8.2 6.76,43.43 4.83,43.43 4.83,31.85 2.9,29.92 0.96,29.92 0.96,25.09 1.93,24.13 R19.P$1
N$2
  Top 0.152: R19.P$2 12.55,24.13 12.55,27.03 R20.P$2
  Bottom 0.152: C16.2 18.34,26.06 16.41,27.99 13.51,27.99 R20.P$2
N$3
  Top 0.152: R22.P$2 17.37,13.51 17.37,16.41 R21.P$2 | C17.1 2.9,15.44 3.86,16.41 3.86,26.06 2.9,27.03 R20.P$1
  Bottom 0.152: R21.P$2 17.37,17.37 7.72,27.03 2.9,27.03 R20.P$1
N$4
  Top 0.152: 20.27,29.92 23.16,32.82 23.16,34.75 C14.1 23.16,35.71 23.16,40.54 19.3,44.4 Q6.1 | 20.27,29.92 19.3,28.96 C16.1 | 20.27,29.92 20.27,14.48 33.78,14.48 L14.P$2
  Bottom 0.152: Q8.1 8.69,41.5 11.58,44.4 19.3,44.4 Q6.1
N$5
  Top 0.152: Q8.3 5.79,41.5 5.79,15.44 C17.2
  Bottom 0.152: 13.51,13.51 17.37,9.65 R40.P$2 | 13.51,13.51 12.55,14.48 C18.2 | 6.76,16.41 9.65,13.51 13.51,13.51 | 6.76,16.41 2.9,20.27 R18.P$2 | 6.76,16.41 5.79,15.44 C17.2
N$6
  Top 0.152: R16.P$2 17.37,5.79 16.41,6.76 16.41,38.61 19.3,41.5 Q6.3
  Bottom 0.152: Q6.3 19.3,41.5 27.03,41.5 Q7.3
N$7
  Bottom 0.152: R18.P$1 12.55,21.23 11.58,22.2 1.93,22.2 0.96,21.23 0.96,0.96 70.46,0.96 72.39,2.9 JP2.6
N$8
  Top 0.152: Q6.2 17.37,43.43 13.51,39.57 13.51,35.71 R15.P$2
N$9
  Top 0.152: 25.09,43.43 25.09,27.03 24.13,26.06 | 24.13,26.06 27.99,26.06 C15.1 | 24.13,26.06 C14.2 | 25.09,43.43 17.37,51.16 17.37,58.88 5.79,70.46 JP4.1 | 25.09,43.43 Q7.2
  Bottom 0.152: R17.P$2 13.51,31.85 15.44,29.92 19.3,29.92 23.16,26.06 C14.2
N$10
  Top 0.152: L12.P$1 154.43,40.54 148.64,40.54 148.64,44.4 L5.OUT$3
N$11
  Bottom 0.152: L14.P$1 33.78,43.43 27.03,50.19 23.16,50.19 21.23,52.12 L11.OUT$3
N$12
  Top 0.152: C20.P$2 97.48,76.25 91.69,82.04 85.9,82.04 D3.A | C29.P$2 79.15,70.46 75.29,74.32 U2.2
  Bottom 0.152: D3.A 84.94,82.04 77.22,74.32 75.29,74.32 U2.2
N$13
  Bottom 0.152: 68.53,66.6 70.46,68.53 73.36,68.53 U1.1 | 68.53,66.6 65.63,63.7 D2.C 64.67,63.7 63.7,63.7 52.12,75.29 C19.P$1 | 68.53,66.6 79.15,66.6 82.04,69.49 C30.P$1
N$14
  Top 0.152: JP2.2 62.74,3.86 63.7,4.83 63.7,72.39 64.67,73.36 D2.A
  Bottom 0.152: D2.A 64.67,73.36 63.7,74.32 57.91,74.32 56.95,75.29 56.95,82.04 75.29,82.04 D3.C
N$15
  Bottom 0.152: JP4.2 4.83,72.39 3.86,71.42 3.86,33.78 28.96,33.78 46.33,16.41 78.18,16.41 R14.P$2
N$16
  Top 0.152: Q1.2 138.02,37.64 137.06,36.68 137.06,22.2 R1.P$2
N$17
  Top 0.152: JP5.2 155.4,69.49 155.4,67.56 JP5.1 155.4,66.6 159.26,62.74 159.26,16.41 155.4,12.55 L12.P$2 | 135.13,39.57 134.16,39.57 134.16,38.61 C1.P$2 133.2,38.61 133.2,36.68 C2.1 | 135.13,39.57 139.95,39.57 Q1.1 | 135.13,39.57 135.13,27.99 C3.P$1
  Bottom 0.152: L12.P$2 154.43,12.55 140.92,26.06 137.06,26.06 135.13,27.99 C3.P$1
N$18
  Top 0.152: R2.P$2 144.78,26.06 146.71,27.99 146.71,36.68 Q2.3
  Bottom 0.152: Q1.3 139.95,36.68 146.71,36.68 Q2.3
N$19
  Top 0.152: Q2.2 144.78,37.64 142.85,35.71 142.85,12.55 141.88,11.58 R3.P$1
  Bottom 0.152: R4.P$1 154.43,8.69 151.54,11.58 141.88,11.58 R3.P$1
N$20
  Top 0.152: C2.2 133.2,33.78 130.3,30.89 130.3,24.13 128.37,22.2 D4.A
  Bottom 0.152: 118.72,18.34 54.05,18.34 48.26,24.13 41.5,24.13 41.5,27.03 43.43,28.96 47.3,28.96 48.26,29.92 C6.2 | 118.72,18.34 120.65,20.27 R23.P$1 | 118.72,18.34 124.51,18.34 127.41,21.23 D4.A
N$21
  Bottom 0.152: U3.16 113.89,55.02 117.75,55.02 R38.P$1
N$22  (via drill 0.33)
  Top 0.152: v134.16,41.5 144.78,52.12 JP1.3
  Bottom 0.152: v134.16,41.5 115.82,41.5 113.89,39.57 U3.10
N$23  (via drill 0.33)
  Top 0.152: v134.16,40.54 147.68,54.05 147.68,58.88 JP1.4
  Bottom 0.152: v134.16,40.54 117.75,40.54 113.89,36.68 U3.9
N$24
  Top 0.152: C28.1 108.1,72.39 JP6.1 107.14,71.42 107.14,64.67 JP8.1 107.14,63.7 107.14,60.81 98.45,52.12 R30.P$2
  Bottom 0.152: D5.C 97.48,48.26 | 97.48,48.26 109.07,48.26 112.93,44.4 U3.12 | 97.48,48.26 97.48,51.16 R30.P$2 | JP1.2 141.88,59.84 138.99,62.74 109.07,62.74 108.1,63.7 JP8.1
N$25
  Top 0.152: D5.A 88.8,48.26 88.8,54.05 87.83,55.02 R37.P$2
N$26
  Top 0.152: C27.2 121.61,48.26 118.72,45.36 118.72,44.4 R35.P$1 | R14.P$1 79.15,27.03 80.11,27.99 80.11,38.61 87.83,46.33 94.59,46.33 94.59,52.12 97.48,55.02 R37.P$1
  Bottom 0.152: R35.P$1 117.75,45.36 115.82,45.36 113.89,47.3 U3.13 112.93,47.3 107.14,53.09 101.35,53.09 98.45,55.98 R37.P$1
N$27
  Top 0.152: U3.1 105.21,54.05 97.48,46.33 97.48,45.36 R29.P$2
  Bottom 0.152: R30.P$1 87.83,51.16 93.62,45.36 97.48,45.36 R29.P$2
N$28
  Bottom 0.152: U3.15 113.89,52.12 117.75,52.12 R36.P$1
N$29
  Top 0.152: U3.8 105.21,36.68 92.66,24.13 92.66,22.2 R32.P$2 93.62,21.23 93.62,14.48 97.48,10.62 C25.2
N$30
  Bottom 0.152: C25.1 95.56,9.65 100.38,4.83 124.51,4.83 JP9.2
N$31
  Top 0.152: R2-H.P$1 136.09,71.42 136.09,74.32 R1-H.P$2
  Bottom 0.152: IC1-H.3 140.92,70.46 136.09,70.46 R2-H.P$1 | C1-H.1 132.23,77.22 135.13,74.32 R1-H.P$2
N$32
  Top 0.152: 107.14,38.61 109.07,36.68 109.07,33.78 C24.2 110.03,32.82 110.03,27.99 R31.P$2 | 107.14,38.61 106.17,39.57 U3.7 | 107.14,38.61 107.14,43.43 106.17,44.4 U3.5
N$33
  Top 0.152: U3.2 105.21,52.12 99.42,46.33 99.42,43.43 97.48,41.5 R27.P$2
N$34
  Top 0.152: JP2.9 80.11,3.86 80.11,27.03 81.08,27.99 81.08,34.75 86.87,40.54 R27.P$1
N$35
  Top 0.152: JP2.7 75.29,2.9 77.22,0.96 83.97,0.96 83.97,27.99 83.01,28.96 R28.P$1
N$36
  Top 0.152: U3.4 105.21,47.3 99.42,41.5 99.42,39.57 97.48,37.64 R25.P$2 97.48,36.68 97.48,34.75 92.66,29.92 R28.P$2
  Bottom 0.152: R26.P$2 110.03,20.27 104.24,26.06 96.52,26.06 93.62,28.96 R28.P$2
N$37  (via drill 0.33)
  Top 0.152: v110.03,37.64 110.03,45.36 106.17,49.23 U3.3 | R23.P$2 120.65,29.92 117.75,27.03 C23.1 117.75,26.06 123.55,20.27 R24.P$1
  Bottom 0.152: 111.96,35.71 116.79,30.89 120.65,30.89 R23.P$2 | 111.96,35.71 v110.03,37.64 | 111.96,35.71 159.26,35.71 159.26,50.19 156.36,53.09 155.4,53.09 155.4,58.88 JP1.7
N$38
  Bottom 0.152: 124.51,28.96 127.41,28.96 D4.C | 124.51,28.96 117.75,28.96 C23.2 | 124.51,28.96 124.51,29.92 R24.P$2
N$39
  Top 0.152: JP2.1 58.88,3.86 52.12,10.62 52.12,20.27 50.19,22.2 50.19,69.49 43.43,76.25 JP3.2
N$40
  Top 0.152: C3.P$2 139.95,27.99 140.92,27.03 140.92,22.2 R3.P$2
N$41
  Top 0.152: Q3.1 60.81,45.36 54.05,45.36 54.05,40.54 C5.P$2 54.05,39.57 54.05,31.85 C7.P$1 | L13.P$2 72.39,12.55 68.53,8.69 68.53,2.9 67.56,1.93 50.19,1.93 50.19,11.58 48.26,13.51 C6.1 48.26,27.99
  Bottom 0.152: Q5.1 48.26,38.61 49.23,39.57 54.05,39.57 C5.P$2 | 48.26,27.99 44.4,27.99 43.43,27.03 C9.1 | 48.26,27.99 50.19,27.99 53.09,30.89 C7.P$1 | 48.26,27.99 C6.1
N$42
  Top 0.152: Q3.2 58.88,44.4 55.98,41.5 55.98,23.16 55.02,22.2 R5.P$1
N$43
  Top 0.152: R6.P$2 61.77,22.2 60.81,23.16 60.81,43.43 Q3.3
  Bottom 0.152: Q3.3 60.81,43.43 67.56,43.43 Q4.3
N$44
  Top 0.152: L13.P$1 72.39,48.26 L6.OUT$3
N$45
  Top 0.152: 40.54,32.82 45.36,37.64 Q5.3 | C11.2 45.36,12.55 42.47,15.44 42.47,18.34 R9.P$1 42.47,19.3 42.47,22.2 R39.P$1 41.5,23.16 41.5,31.85 40.54,32.82 | 40.54,32.82 C10.1
N$46
  Top 0.152: C7.P$2 58.88,31.85 59.84,30.89 59.84,12.55 58.88,11.58 R7.P$2
N$47
  Top 0.152: R9.P$2 42.47,8.69 50.19,0.96 69.49,0.96 69.49,2.9 JP2.5
N$48
  Top 0.152: Q4.2 65.63,44.4 65.63,24.13 R8.P$1
  Bottom 0.152: R8.P$1 60.81,24.13 58.88,22.2 R7.P$1
N$49
  Top 0.152: Q5.2 47.3,40.54 38.61,49.23 R10.P$2
N$50
  Top 0.152: R10.P$1 48.26,49.23 46.33,47.3 46.33,46.33 R11.P$2
  Bottom 0.152: C9.2 43.43,31.85 43.43,45.36 45.36,45.36 R11.P$2
N$51
  Top 0.152: R13.P$2 35.71,56.95 35.71,54.05 R12.P$1 35.71,53.09 35.71,46.33 R11.P$1 35.71,45.36 35.71,43.43 40.54,38.61 C10.2
N$52
  Bottom 0.152: R33A.P$1 111,16.41 113.89,13.51 137.06,13.51 138.99,11.58 138.99,7.72 124.51,7.72 JP9.3
N$53
  Top 0.152: R33B.P$1 110.03,12.55 110.03,7.72 114.86,2.9 123.55,2.9 JP9.1
N$54
  Top 0.152: R33B.P$2 100.38,13.51 100.38,16.41 R33A.P$2 100.38,17.37 102.31,19.3 102.31,22.2 100.38,24.13 R34.P$1 | R1-H.P$1 125.48,74.32 116.79,65.63 116.79,30.89 112.93,27.03 112.93,8.69 111.96,7.72 C26.P$2
  Bottom 0.152: 99.42,12.55 106.17,5.79 109.07,5.79 111,7.72 C26.P$2 | 99.42,12.55 91.69,12.55 83.01,3.86 JP2.10 | 99.42,12.55 R33B.P$2
N$55
  Top 0.152: R4-H.P$1 125.48,65.63 125.48,67.56 R3-H.P$1 125.48,68.53 125.48,70.46 R2-H.P$2
  Bottom 0.152: C1-H.2 129.34,77.22 129.34,71.42 126.44,71.42 R2-H.P$2 | IC1-H.6 147.68,70.46 143.81,66.6 127.41,66.6 126.44,67.56 R3-H.P$1
N$56
  Top 0.152: R3-H.P$2 136.09,67.56 137.06,66.6 137.06,63.7 136.09,62.74 127.41,62.74 127.41,81.08 JP7.1
N$57
  Top 0.152: R4-H.P$2 136.09,65.63 133.2,68.53 133.2,78.18 130.3,81.08 JP7.2
N$58
  Bottom 0.152: JP10.2 10.62,5.79 9.65,4.83 4.83,4.83 U$2.P$1
N$59
  Top 0.152: JP11.2 145.75,82.04 155.4,82.04 U$1.P$1
N$60
  Bottom 0.152: JP12.2 10.62,80.11 9.65,81.08 4.83,81.08 U$3.P$1
VNEG
  Top 0.152: R6.P$1 61.77,10.62 59.84,10.62 58.88,9.65 55.98,9.65 55.98,18.34 52.12,22.2 R39.P$2 52.12,23.16 52.12,62.74 70.46,81.08 | 70.46,81.08 68.53,83.01 C22.2 | 70.46,81.08 75.29,76.25 U2.1
  Bottom 0.152: R39.P$2 52.12,23.16 65.63,36.68 86.87,36.68 R25.P$1 | JP2.3 65.63,3.86 68.53,6.76 81.08,6.76 82.04,7.72 82.04,10.62 62.74,10.62 R6.P$1 | 93.62,76.25 85.9,83.97 68.53,83.97 C22.2 | 93.62,76.25 100.38,69.49 139.95,69.49 140.92,68.53 IC1-H.4 | 93.62,76.25 79.15,61.77 54.05,61.77 46.33,54.05 R12.P$2

### Text on the board
tNames: GND | Marky's House / THEREMIN / R1 | GND | 2 - VCA Proc. / / 1 - Vol Osc | HEADPHONE AMP | NORMAL | GUITAR / AMP | VOL OSC & TUNING | FIXED PITCH / OSC & TUNING | DETECTOR, VCA & PROCESSOR | VAR PITCH OSC